# Altium schematic sheet Sensors.SchDoc
size A3
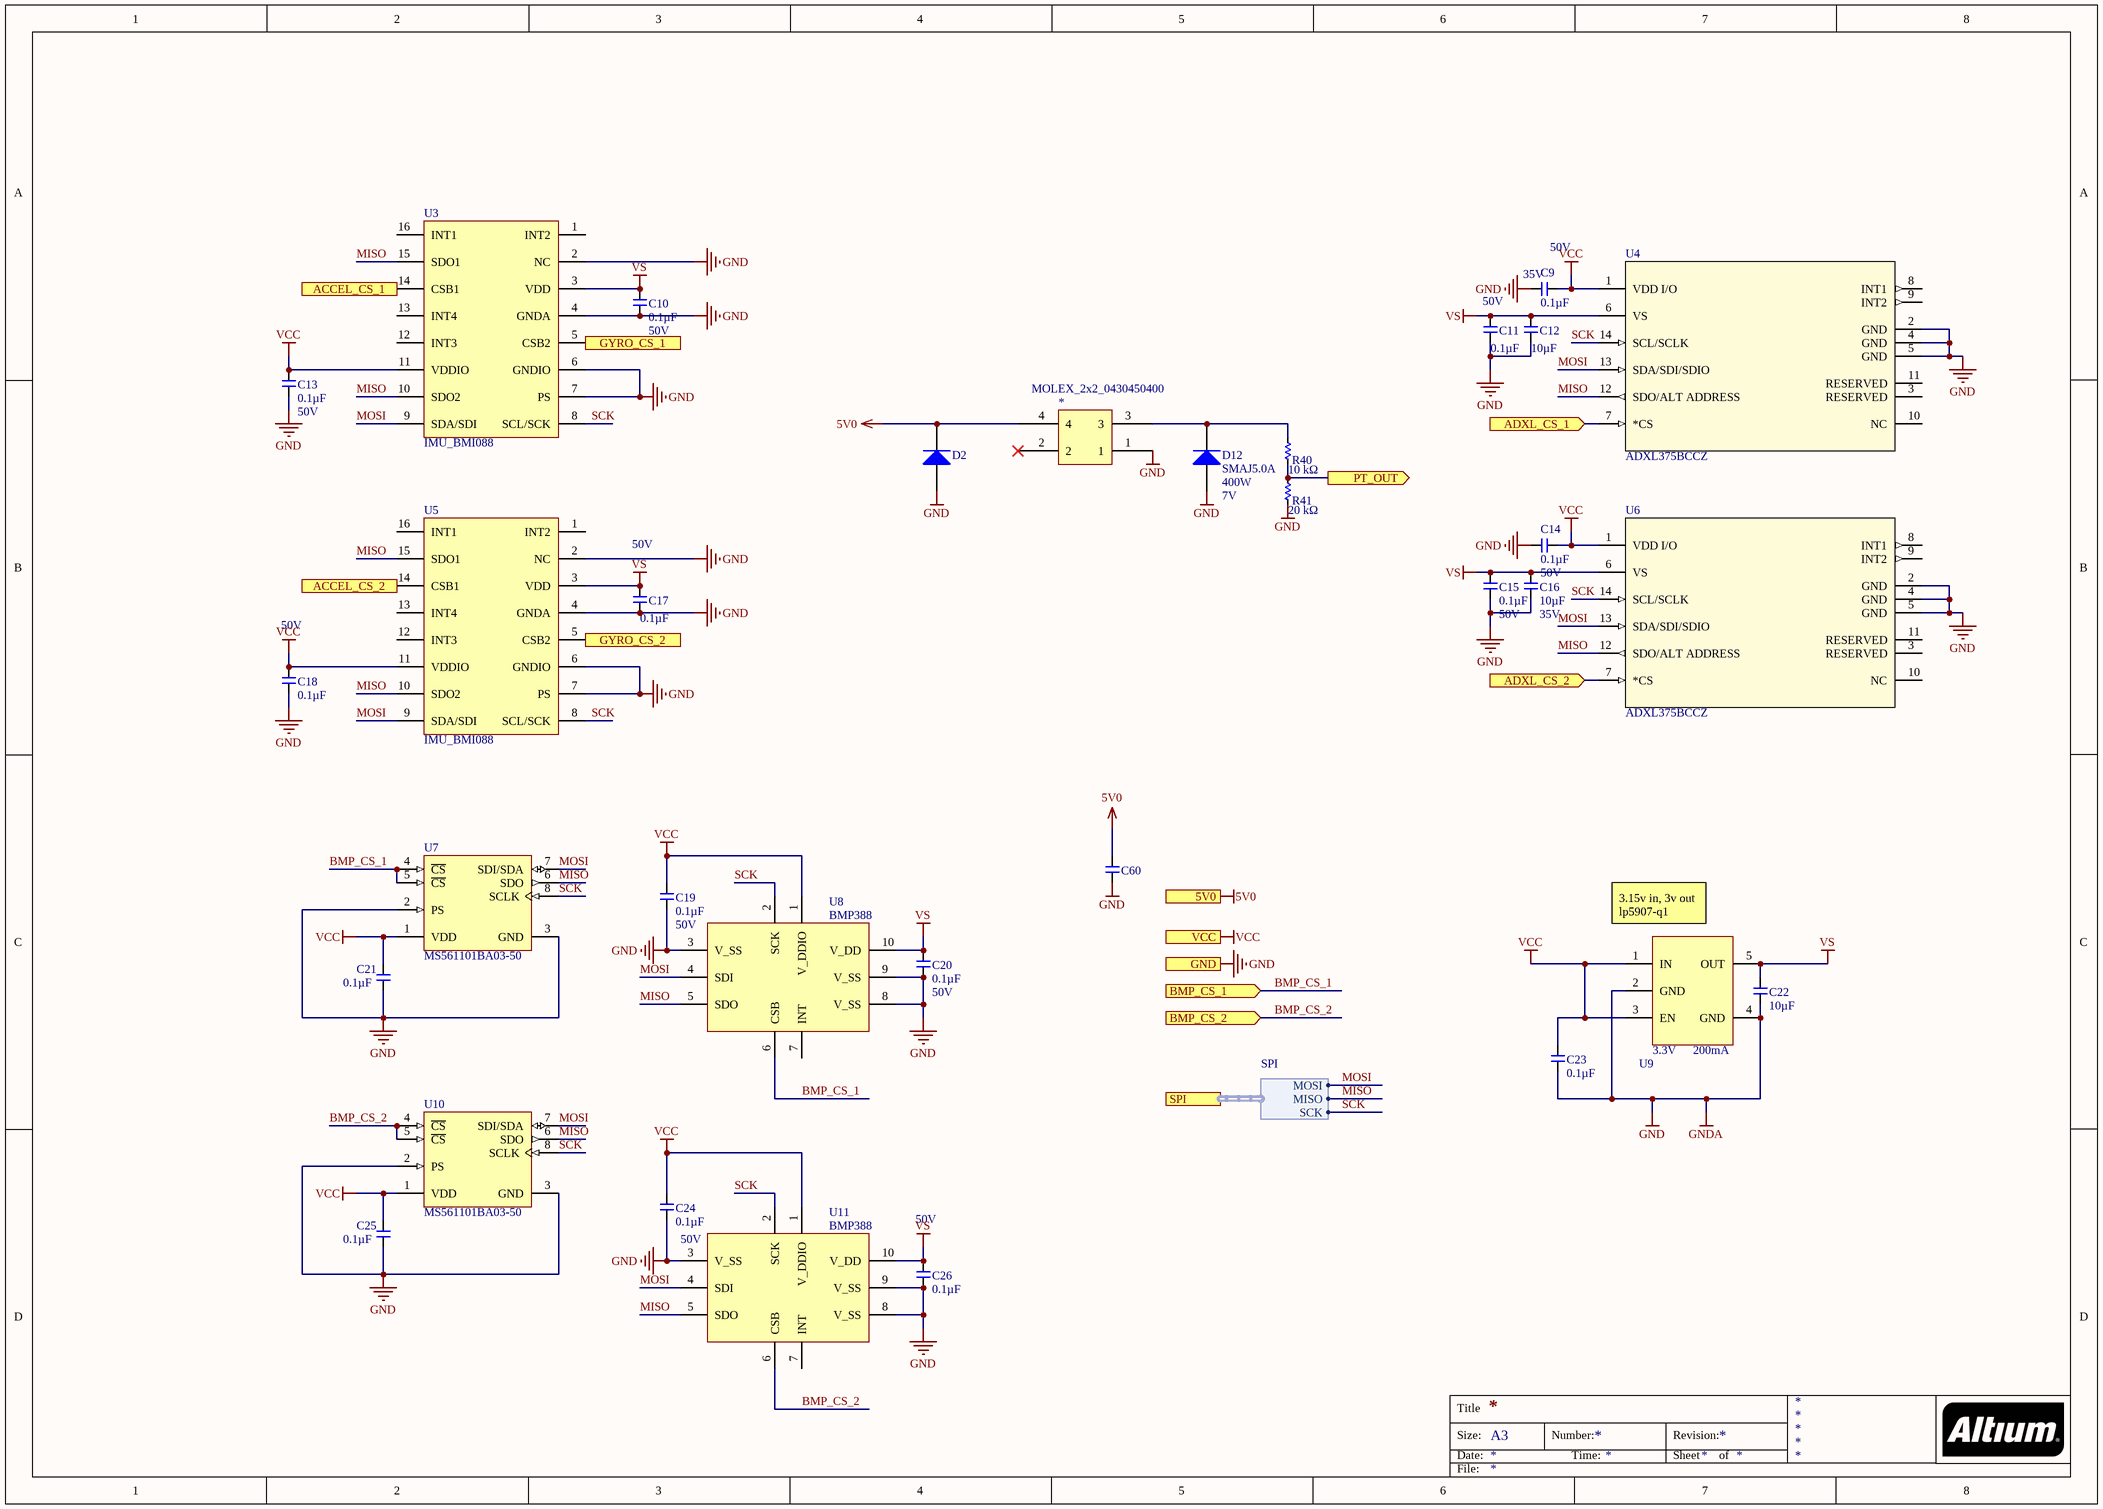
[diagram p0: Sensors.SchDoc]

## Parts
*  MOLEX_2x2_0430450400  [MOLEX_2x2_0430450400]
C9  Capacitance (shorthand): 0.1µF  Rated Voltage: 50V  [C0603]  (hidden comment: 490-1519-1-ND)
C10  Capacitance (shorthand): 0.1µF  Rated Voltage: 50V  [C0603]  (hidden comment: 490-1519-1-ND)
C11  Capacitance (shorthand): 0.1µF  Rated Voltage: 50V  [C0603]  (hidden comment: 490-1519-1-ND)
C12  Capacitance (shorthand): 10µF  Rated Voltage: 35V  [C0603]  (hidden comment: 490-13248-1-ND)
C13  Capacitance (shorthand): 0.1µF  Rated Voltage: 50V  [C0603]  (hidden comment: 490-1519-1-ND)
C14  Capacitance (shorthand): 0.1µF  Rated Voltage: 50V  [C0603]  (hidden comment: 490-1519-1-ND)
C15  Capacitance (shorthand): 0.1µF  Rated Voltage: 50V  [C0603]  (hidden comment: 490-1519-1-ND)
C16  Capacitance (shorthand): 10µF  Rated Voltage: 35V  [C0603]  (hidden comment: 490-13248-1-ND)
C17  Capacitance (shorthand): 0.1µF  Rated Voltage: 50V  [C0603]  (hidden comment: 490-1519-1-ND)
C18  Capacitance (shorthand): 0.1µF  Rated Voltage: 50V  [C0603]  (hidden comment: 490-1519-1-ND)
C19  Capacitance (shorthand): 0.1µF  Rated Voltage: 50V  [C0603]  (hidden comment: 490-1519-1-ND)
C20  Capacitance (shorthand): 0.1µF  Rated Voltage: 50V  [C0603]  (hidden comment: 490-1519-1-ND)
C21  Capacitance (shorthand): 0.1µF  [C0603]  (hidden comment: 490-1519-1-ND)
C22  Capacitance (shorthand): 10µF  [C0603]  (hidden comment: 490-13248-1-ND)
C23  Capacitance (shorthand): 0.1µF  [C0603]  (hidden comment: 490-1519-1-ND)
C24  Capacitance (shorthand): 0.1µF  Rated Voltage: 50V  [C0603]  (hidden comment: 490-1519-1-ND)
C25  Capacitance (shorthand): 0.1µF  [C0603]  (hidden comment: 490-1519-1-ND)
C26  Capacitance (shorthand): 0.1µF  Rated Voltage: 50V  [C0603]  (hidden comment: 490-1519-1-ND)
C60  490-1519-1-ND  [C0603]  (value not drawn)
D2  SMAJ5.0A  [BOUR-SMA-2_V]  (value not drawn)
D12  SMAJ5.0A  Max Power Dissipation: 400W  Breakdown Voltage: 7V  [BOUR-SMA-2_V]
R40  Resistance: 10 kΩ  [R0603]  (hidden comment: 311-10.0KHRCT-ND)
R41  Resistance: 20 kΩ  [R0603]  (hidden comment: 311-20.0KHRCT-ND)
U3  IMU_BMI088  [BMI088]
U4  ADXL375BCCZ  [LGA_CC-14-1]
U5  IMU_BMI088  [BMI088]
U6  ADXL375BCCZ  [LGA_CC-14-1]
U7  MS561101BA03-50  [MSI-MS561101BA03-50-8_V]
U8  BMP388  [8 pin LGA]
U9  Voltage - Output: 3.3V  Current - Output: 200mA  [5SOT23]  (hidden comment: LDO_TLV70033QDDCRQ1)
U10  MS561101BA03-50  [MSI-MS561101BA03-50-8_V]
U11  BMP388  [8 pin LGA]

## Ports
5V0 (in), ACCEL_CS_1 (in), ACCEL_CS_2 (in), ADXL_CS_1 (in), ADXL_CS_2 (in), BMP_CS_1 (in), BMP_CS_2 (in), GND (in), GYRO_CS_1 (in), GYRO_CS_2 (in), PT_OUT (out), SPI (harness SPI), VCC (in)

## Harnesses
SPI: MISO, MOSI, SCK

## Nets
5V0: *.4 C60.1 D2.2(K) ; port 5V0
GND: *.1 C9.2 C10.2 C11.1 C12.2 C13.2 C14.2 C15.1 C16.2 C17.2 C18.2 C19.2 C20.2 C21.2 C22.2 C23.2 C24.2 C25.2 C26.2 C60.2 D2.1(A) D12.1(A) R41.1 U3.2(NC) U3.4(GNDA) U3.6(GNDIO) U3.7(PS) U4.2(GND) U4.4(GND) U4.5(GND) U5.2(NC) U5.4(GNDA) U5.6(GNDIO) U5.7(PS) U6.2(GND) U6.4(GND) U6.5(GND) U7.2(PS) U7.3(GND) U8.3(V_SS) U8.8(V_SS) U8.9(V_SS) U9.2(GND) U9.4(GND) U10.2(PS) U10.3(GND) U11.3(V_SS) U11.8(V_SS) U11.9(V_SS) ; port GND  [also labelled GNDA]
VCC: C9.1 C13.1 C14.1 C18.1 C19.1 C21.1 C23.1 C24.1 C25.1 U3.11(VDDIO) U4.1(VDD_I/O) U5.11(VDDIO) U6.1(VDD_I/O) U7.1(VDD) U8.1(V_DDIO) U9.1(IN) U9.3(EN) U10.1(VDD) U11.1(V_DDIO) ; port VCC
VS: C10.1 C11.2 C12.1 C15.2 C16.1 C17.1 C20.1 C22.1 C26.1 U3.3(VDD) U4.6(VS) U5.3(VDD) U6.6(VS) U8.10(V_DD) U9.5(OUT) U11.10(V_DD)
ACCEL_CS_1: U3.14(CSB1) ; port ACCEL_CS_1
ACCEL_CS_2: U5.14(CSB1) ; port ACCEL_CS_2
ADXL_CS_1: U4.7(*CS) ; port ADXL_CS_1
ADXL_CS_2: U6.7(*CS) ; port ADXL_CS_2
BMP_CS_1: U7.4(~{CS}) U7.5(~{CS}) U8.6(CSB) ; port BMP_CS_1
BMP_CS_2: U10.4(~{CS}) U10.5(~{CS}) U11.6(CSB) ; port BMP_CS_2
GYRO_CS_1: U3.5(CSB2) ; port GYRO_CS_1
GYRO_CS_2: U5.5(CSB2) ; port GYRO_CS_2
MISO: U3.10(SDO2) U3.15(SDO1) U4.12(SDO/ALT_ADDRESS) U5.10(SDO2) U5.15(SDO1) U6.12(SDO/ALT_ADDRESS) U7.6(SDO) U8.5(SDO) U10.6(SDO) U11.5(SDO) ; port SPI.MISO
MOSI: U3.9(SDA/SDI) U4.13(SDA/SDI/SDIO) U5.9(SDA/SDI) U6.13(SDA/SDI/SDIO) U7.7(SDI/SDA) U8.4(SDI) U10.7(SDI/SDA) U11.4(SDI) ; port SPI.MOSI
PT_OUT: R40.1 R41.2 ; port PT_OUT
SCK: U3.8(SCL/SCK) U4.14(SCL/SCLK) U5.8(SCL/SCK) U6.14(SCL/SCLK) U7.8(SCLK) U8.2(SCK) U10.8(SCLK) U11.2(SCK) ; port SPI.SCK
Net*_3: *.3 D12.2(K) R40.2

Not connected (* = marked no-connect by the designer): * 2*; U3 1(INT2) 12(INT3) 13(INT4) 16(INT1); U4 3(RESERVED) 8(INT1) 9(INT2) 10(NC) 11(RESERVED); U5 1(INT2) 12(INT3) 13(INT4) 16(INT1); U6 3(RESERVED) 8(INT1) 9(INT2) 10(NC) 11(RESERVED); U8 7(INT); U11 7(INT)

## Notes on the sheet
- (near U9) 3.15v in, 3v out
  lp5907-q1
- Title
- Size:
- Date:
- A3
- Number:
- Time:
- Revision:
- Sheet
- of
- File:

## Library data of the parts
* = CMP-030-0039-1: MICROFIT CONN HEADER R/A 4POS 3MM; Design Item ID: MOLEX_2x2_0430450400; Source: connector.SchLib
C9-C11 C13-C15 C17-C21 C23-C26 C60 = CMP-119-0065-1: CAP CER 0603 0.1µF X7R 50V 10%; Manufacturer: Murata Electronics North America; Capacitance - pF (Machine readable): #NAME?; Dielectric: X7R
  C21 C25: Rated Voltage: 50V
  C60: Capacitance (shorthand): 0.1µF; Rated Voltage: 50V
C12 C16 C22 = CMP-119-0071-1: CAP CER 10UF 35V X5R 0603 20%; Manufacturer: Murata Electronics North America; Capacitance - pF (Machine readable): #NAME?; Dielectric: X5R
D2 = CMP-00017-1: BOURNS - SMAJ5.0A - TVS Diode, SMAJ Series, Unidirectional, 5 V, 9.2 V, DO-214AC (SMA), 2 Pins; Min Breakdown Voltage: 6.4V; ESD Protection: Yes; Test Current: 10mA; Clamping Voltage: 9.2V; Leakage Current: 800uA; Max Breakdown Voltage: 7V; Number of Unidirectional Channels: 1; Operating Supply Voltage: 3.5V; Peak Pulse Current: 43.5A; Power Line Protection: No; Peak Pulse Power: 400W; Reverse Standoff Voltage: 5V; Diode Type: ZENER; Element Configuration: Single; Max Surge Current: 40A; Height: 2.42mm; Case/Package: DO-214AC; Max Reverse Leakage Current: 800uA; Packaging: Tape and Reel; REACH SVHC: No SVHC; Direction: Unidirectional; Series: SMAJ; Radiation Hardening: No; Mount: Surface Mount; Max Operating Temperature: 150°C; Package Quantity: 1; Width: 2.92mm; Reverse Breakdown Voltage: 6.4V; Number of Channels: 1; Polarity: Unidirectional; Min Operating Temperature: -55°C; Length: 4.57mm; Resistor Type: Zener; Max Power Dissipation: 400W; Number of Pins: 2; Breakdown Voltage: 7V; Number of Elements: 1; Termination: SMD/SMT
D12 = CMP-00017-1: BOURNS - SMAJ5.0A - TVS Diode, SMAJ Series, Unidirectional, 5 V, 9.2 V, DO-214AC (SMA), 2 Pins; Min Breakdown Voltage: 6.4V; ESD Protection: Yes; Test Current: 10mA; Clamping Voltage: 9.2V; Leakage Current: 800uA; Number of Unidirectional Channels: 1; Operating Supply Voltage: 3.5V; Peak Pulse Current: 43.5A; Power Line Protection: No; Reverse Standoff Voltage: 5V; Diode Type: ZENER; Element Configuration: Single; Max Surge Current: 40A; Height: 2.42mm; Case/Package: DO-214AC; Max Breakdown Voltage: 7V; Max Reverse Leakage Current: 800uA; Packaging: Tape and Reel; REACH SVHC: No SVHC; Direction: Unidirectional; Series: SMAJ; Radiation Hardening: No; Mount: Surface Mount; Max Operating Temperature: 150°C; Peak Pulse Power: 400W; Package Quantity: 1; Width: 2.92mm; Reverse Breakdown Voltage: 6.4V; Number of Channels: 1; Polarity: Unidirectional; Min Operating Temperature: -55°C; Length: 4.57mm; Resistor Type: Zener; Number of Pins: 2; Number of Elements: 1; Termination: SMD/SMT
R40 = CMP-126-0273-2: RES SMD 10K OHM 1% 1/10W 0603; Manufacturer: Yageo; Manufacturer Part Number: RC0603FR-0710KL; Power (Watts): 0.1W, 1/10W; Resistance (Sortable): 10000; Temperature Coefficient: ±100ppm/°C; Tolerance: ±1%; Datasheets: http://www.yageo.com/documents/recent/PYu-RC_Group_51_RoHS_L_9.pdf; Image: //media.digikey.com/Renders/Yageo%20Renders/0603-(1608-Metric).jpg; Operating Temperature: -55°C ~ 155°C
R41 = CMP-126-0304-2: RES SMD 20K OHM 1% 1/10W 0603; Manufacturer Part Number: RC0603FR-0720KL; Manufacturer: Yageo; Temperature Coefficient: ±100ppm/°C; Power (Watts): 0.1W, 1/10W; Resistance (Sortable): 20000; Datasheets: http://www.yageo.com/documents/recent/PYu-RC_Group_51_RoHS_L_9.pdf; Operating Temperature: -55°C ~ 155°C; Image: //media.digikey.com/Renders/Yageo%20Renders/0603-(1608-Metric).jpg; Tolerance: ±1%
U3 U5 = CMP-074-0017-1: Bosch BMI088; Design Item ID: IMU_BMI088; Source: sensor.SchLib
U4 U6 = CMP-074-0018-1: 200G Accelcerometer; Manufacturer: Analog Devices; Manufacturer Part Number: ADXL375BCCZ-RL7; Bandwidth: 1kHz; Interface: I2C,SPI; Nominal Supply Current: 145uA; -3db Bandwidth: 1.6kHz; Output Type: Digital; Axis: X, Y, Z; Sensitivity: 20.5LSB/g; Operating Supply Voltage: 3.6V; Stock 1: 3410; Pricing 1: 1=10.9, 10=10.021, 100=8.463, 500=7.5284 (USD); Mount: Surface Mount; Number of Pins: 14; Min Operating Temperature: -40°C; Max Operating Temperature: 85°C; Package Quantity: 1; Operating Supply Current: 145uA; Lead Free: Contains Lead; Design Item ID: ADXL375BCCZ; Source: sensor.SchLib
U7 U10 = CMP-00025-1: Pressure Sensor 1.44V to 3.6V 0.01bar to 1.2bar Absolute 8-Pin QFN T/R; Operating Supply Current: 12.5uA; Output Type: Digital; Resolution: 24b; Operating Supply Voltage: 3V; Interface: I2C,SPI; Min Supply Voltage: 1.8V; Packaging: Tape and Reel; Number of Pins: 8; Case/Package: QFN; Nominal Supply Current: 12.5uA; Min Operating Temperature: -40°C; REACH SVHC: No SVHC; Max Supply Voltage: 3.6V; RoHS Compliant: Yes; Output Voltage: 3.6V; Pressure Type: Absolute; Radiation Hardening: No; Max Operating Temperature: 85°C; Package Quantity: 3600; Mount: Surface Mount
U8 U11 = CMP-074-0001-1: SENSOR PRESSURE ABS; Manufacturer: Bosch Sensortec; Manufacturer Part Number: BMP388; Stock 1: 46050; Pricing 1: 1=3.93, 5=3.466, 10=3.061, 25=2.4832, 50=2.1946, 100=2.1368, 500=1.7903, 1000=1.6748, 5000=1.5593 (USD); ComponentLink1URL: https://ae-bst.resource.bosch.com/media/_tech/media/product_flyer/BST-BMP388-FL000-00.pdf; ComponentLink1Description: https://ae-bst.resource.bosch.com/media/_tech/media/product_flyer/BST-BMP388-FL000-00.pdf; Design Item ID: BMP388; Source: sensor.SchLib
U9 = CMP-048-0071-1: IC REG LDO 3.3V .2A SOT23-5; Manufacturer: Texas Instruments; Number of Regulators: 1; Regulator Topology: Positive Fixed; Current - Limit (Min): 220mA; Voltage - Input: Up to 5.5V; Manufacturer Part Number: TLV70033QDDCRQ1; Stock 1: 889; Pricing 1: 1=0.58, 10=0.507, 25=0.444, 100=0.1661, 250=0.16296, 500=0.1599, 750=0.15683 (USD); RoHS: RoHS Compliant; Packaging: Cut Tape (CT); ComponentLink1URL: http://www.ti.com/lit/ds/symlink/tlv70033-q1.pdf; ComponentLink1Description: Datasheet; Voltage - Dropout (Typical): -; Operating Temperature: -40°C ~ 125°C; Mounting Type: Surface Mount; Package / Case: SOT-23-5 Thin, TSOT-23-5; Supplier Device Package: SOT-5; Design Item ID: LDO_TLV70033QDDCRQ1; Source: ic_pmic.SchLib